# EAGLE design esmsx (EAGLE 9.0.1)
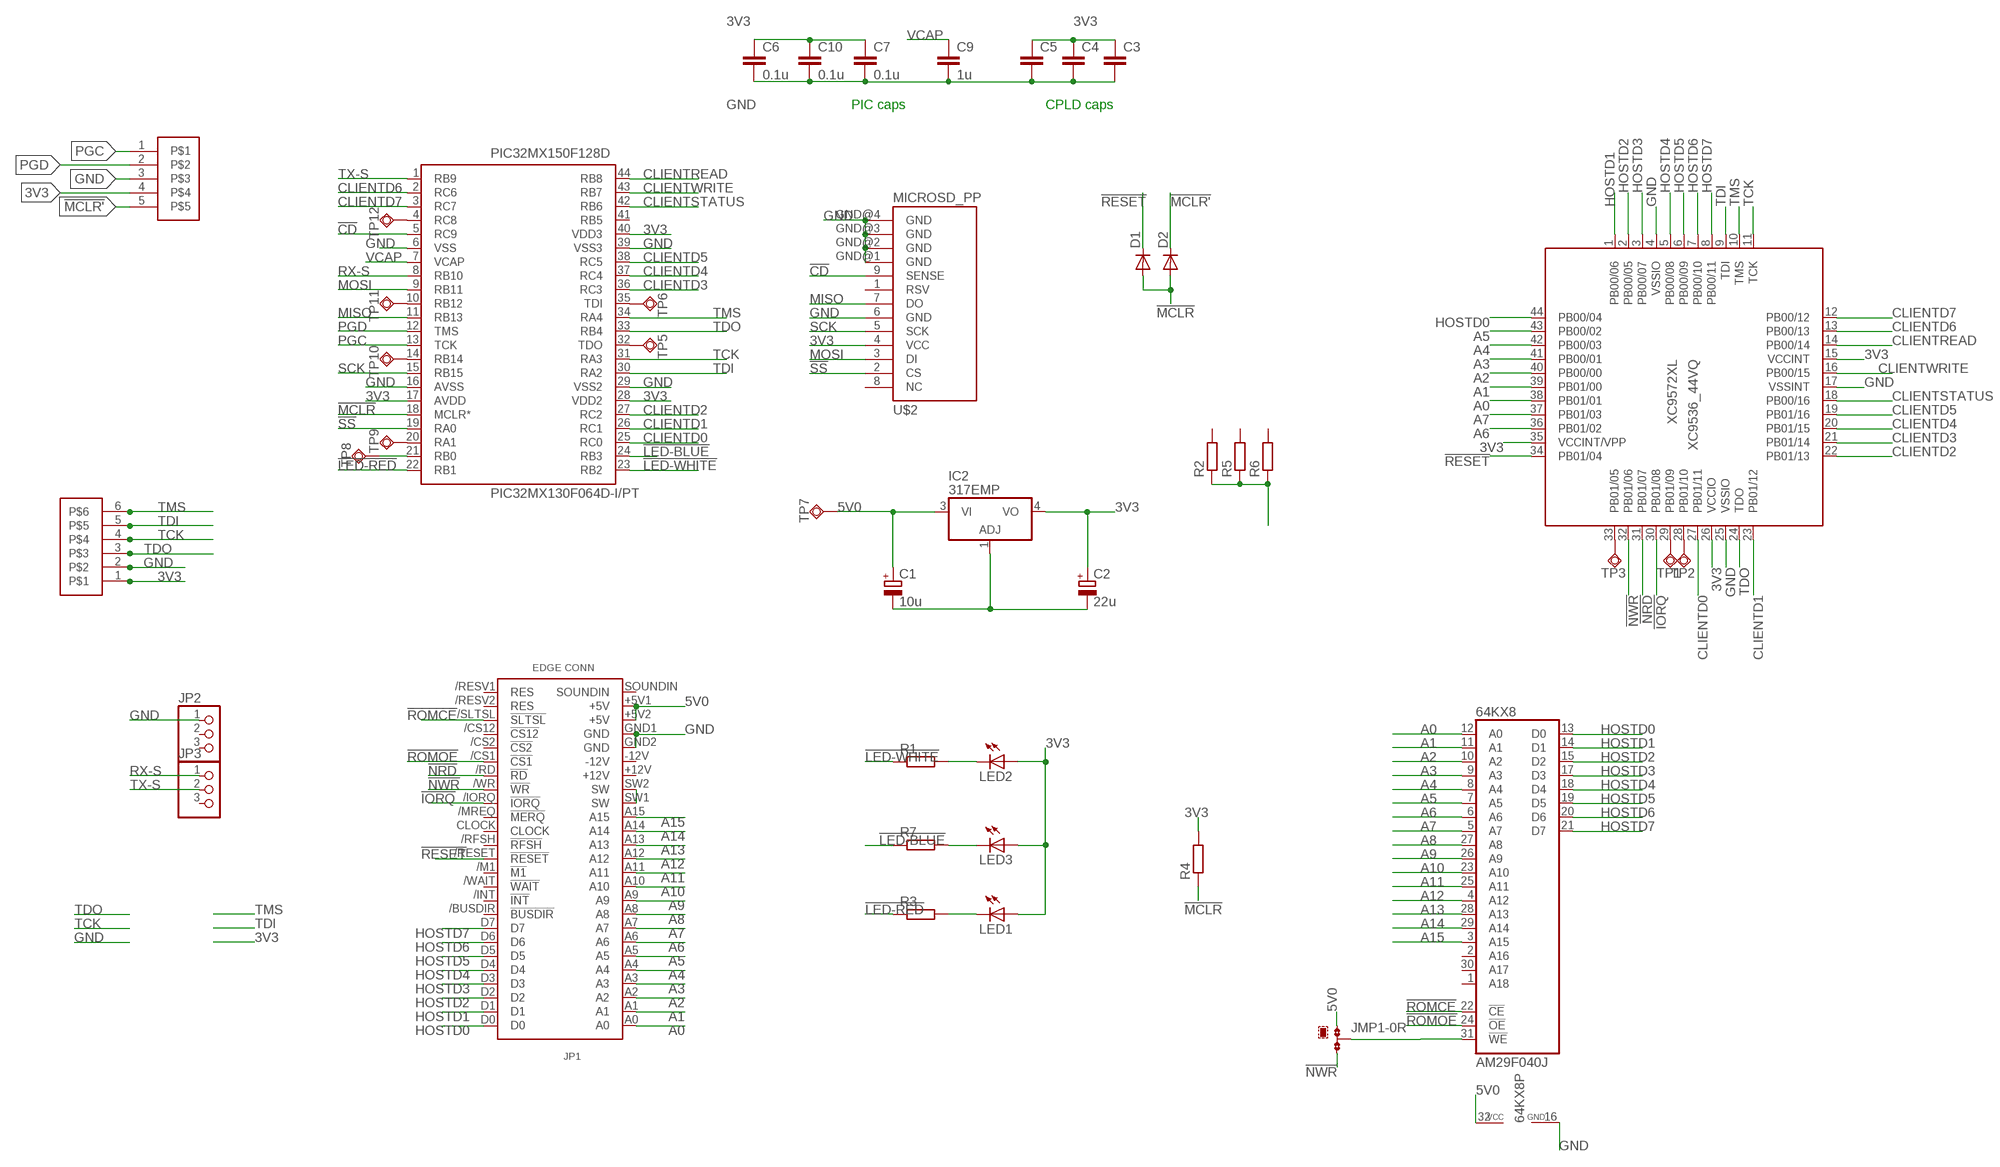
[diagram p0: schematic, sheet 1]

## Parts
64KX8  AM29F040J  [PLCC32R]
C1  10u  CPOL-EUSMCB  [SMC_B]
C2  22u  CPOL-EUSMCB  [SMC_B]
C3  C-EUC0805  [C0805]
C4  C-EUC0805  [C0805]
C5  C-EUC0805  [C0805]
C6  0.1u  C-EUC0805  [C0805]
C7  0.1u  C-EUC0805  [C0805]
C9  1u  C-EUC0805  [C0805]
C10  0.1u  C-EUC0805  [C0805]
D1  DIODE-SOD123  [SOD123]
D2  DIODE-SOD123  [SOD123]
IC2  317EMP  [SOT223]
JMP1  0R-JUMPA  [A0R-JMP]
JP1  MSXCART  [MSXCART]
JP2  PINHD-1X3  [1X03]
JP3  PINHD-1X3  [1X03]
LED1  LEDCHIPLED_1206  [CHIPLED_1206]
LED2  LEDCHIPLED_1206  [CHIPLED_1206]
LED3  LEDCHIPLED_1206  [CHIPLED_1206]
PIC32MX150F128D  PIC32MX130F064D-I/PT  [QFP80P1200X1200X120-44N]
R1  R-EU_R0805W  [R0805W]
R2  R-EU_R0805W  [R0805W]
R3  R-EU_R0805W  [R0805W]
R4  R-EU_R0805W  [R0805W]
R5  R-EU_R0805W  [R0805W]
R6  R-EU_R0805W  [R0805W]
R7  R-EU_R0805W  [R0805W]
TP1  TPSQTP20SQ  [TP20SQ]
TP2  TPSQTP20SQ  [TP20SQ]
TP3  TPSQTP20SQ  [TP20SQ]
TP5  TPSQTP20SQ  [TP20SQ]
TP6  TPSQTP20SQ  [TP20SQ]
TP7  TPSQTP20SQ  [TP20SQ]
TP8  TPSQTP20SQ  [TP20SQ]
TP9  TPSQTP20SQ  [TP20SQ]
TP10  TPSQTP20SQ  [TP20SQ]
TP11  TPSQTP20SQ  [TP20SQ]
TP12  TPSQTP20SQ  [TP20SQ]
U$2  MICROSD_PP  [MICROSD_PP]
U$3  6PIN  [1X04-1.27MM]
U$4  5PIN  [1X05-1.27MM]
XC9572XL  XC9536_44VQ  [SQFP-S-10X10-44]

## Nets
3V3: C2.+ C3.1 C4.1 C5.1 C6.1 C7.1 C10.1 IC2.4(VO) LED1.A LED2.A LED3.A PIC32MX150F128D.17(AVDD) PIC32MX150F128D.28(VDD2) PIC32MX150F128D.40(VDD3) R4.2 U$2.4(VCC) U$3.1 U$4.4 XC9572XL.15(VCCINT) XC9572XL.26(VCCIO) XC9572XL.35(VCCINT/VPP)
5V0: 64KX8.31(!WE) 64KX8.32(VCC) C1.+ IC2.3(VI) JMP1.1 JMP1.2 JP1.+5V1(+5V) JP1.+5V2(+5V) R2.1 R5.1 R6.1 TP7.TP
!CD: PIC32MX150F128D.5(RC9) U$2.9(SENSE)
!ERR': LED2.C R1.2
!IORQ: JP1./IORQ(!IORQ) XC9572XL.30(PB01/08)
!LED-BLUE: PIC32MX150F128D.24(RB3) R7.1
!LED-RED: PIC32MX150F128D.22(RB1) R3.1
!LED-WHITE: PIC32MX150F128D.23(RB2) R1.1
!MCLR: D1.A D2.A PIC32MX150F128D.18(MCLR*) R4.1
!MCLR': D2.C U$4.5
!NRD: JP1./RD(!RD) XC9572XL.31(PB01/07)
!NWR: JMP1.3 JP1./WR(!WR) XC9572XL.32(PB01/06)
!RESET: D1.C JP1./RESET(!RESET) XC9572XL.34(PB01/04)
!ROMCE: 64KX8.22(!CE) JP1./SLTSL(!SLTSL)
!ROMOE: 64KX8.24(!OE) JP1./CS1(!CS1)
!SS: PIC32MX150F128D.19(RA0) U$2.2(CS)
A0: 64KX8.12(A0) JP1.A0 XC9572XL.38(PB01/01)
A1: 64KX8.11(A1) JP1.A1 XC9572XL.39(PB01/00)
A2: 64KX8.10(A2) JP1.A2 XC9572XL.40(PB00/00)
A3: 64KX8.9(A3) JP1.A3 XC9572XL.41(PB00/01)
A4: 64KX8.8(A4) JP1.A4 XC9572XL.42(PB00/03)
A5: 64KX8.7(A5) JP1.A5 XC9572XL.43(PB00/02)
A6: 64KX8.6(A6) JP1.A6 XC9572XL.36(PB01/02)
A7: 64KX8.5(A7) JP1.A7 XC9572XL.37(PB01/03)
A8: 64KX8.27(A8) JP1.A8
A9: 64KX8.26(A9) JP1.A9
A10: 64KX8.23(A10) JP1.A10
A11: 64KX8.25(A11) JP1.A11
A12: 64KX8.4(A12) JP1.A12
A13: 64KX8.28(A13) JP1.A13
A14: 64KX8.29(A14) JP1.A14
A15: 64KX8.3(A15) JP1.A15
CLIENTD0: PIC32MX150F128D.25(RC0) XC9572XL.27(PB01/11)
CLIENTD1: PIC32MX150F128D.26(RC1) XC9572XL.23(PB01/12)
CLIENTD2: PIC32MX150F128D.27(RC2) XC9572XL.22(PB01/13)
CLIENTD3: PIC32MX150F128D.36(RC3) XC9572XL.21(PB01/14)
CLIENTD4: PIC32MX150F128D.37(RC4) XC9572XL.20(PB01/15)
CLIENTD5: PIC32MX150F128D.38(RC5) XC9572XL.19(PB01/16)
CLIENTD6: PIC32MX150F128D.2(RC6) XC9572XL.13(PB00/13)
CLIENTD7: PIC32MX150F128D.3(RC7) XC9572XL.12(PB00/12)
CLIENTREAD: PIC32MX150F128D.44(RB8) XC9572XL.14(PB00/14)
CLIENTSTATUS: PIC32MX150F128D.42(RB6) XC9572XL.18(PB00/16)
CLIENTWRITE: PIC32MX150F128D.43(RB7) XC9572XL.16(PB00/15)
GND: 64KX8.16(GND) C1.- C2.- C3.2 C4.2 C5.2 C6.2 C7.2 C9.2 C10.2 IC2.1(ADJ) JP1.GND1(GND) JP1.GND2(GND) JP2.1 PIC32MX150F128D.6(VSS) PIC32MX150F128D.16(AVSS) PIC32MX150F128D.29(VSS2) PIC32MX150F128D.39(VSS3) U$2.6(GND) U$2.GND@1(GND) U$2.GND@2(GND) U$2.GND@3(GND) U$2.GND@4(GND) U$3.2 U$4.3 XC9572XL.4(VSSIO) XC9572XL.17(VSSINT) XC9572XL.25(VSSIO)
HOSTD0: 64KX8.13(D0) JP1.D0 XC9572XL.44(PB00/04)
HOSTD1: 64KX8.14(D1) JP1.D1 XC9572XL.1(PB00/06)
HOSTD2: 64KX8.15(D2) JP1.D2 XC9572XL.2(PB00/05)
HOSTD3: 64KX8.17(D3) JP1.D3 XC9572XL.3(PB00/07)
HOSTD4: 64KX8.18(D4) JP1.D4 XC9572XL.5(PB00/08)
HOSTD5: 64KX8.19(D5) JP1.D5 XC9572XL.6(PB00/09)
HOSTD6: 64KX8.20(D6) JP1.D6 XC9572XL.7(PB00/10)
HOSTD7: 64KX8.21(D7) JP1.D7 XC9572XL.8(PB00/11)
MISO: PIC32MX150F128D.11(RB13) U$2.7(DO)
MOSI: PIC32MX150F128D.9(RB11) U$2.3(DI)
N$1: LED1.C R3.2
N$2: JP1.SW1(SW) JP1.SW2(SW)
N$4: PIC32MX150F128D.21(RB0) TP8.TP
N$6: TP1.TP XC9572XL.29(PB01/09)
N$7: TP2.TP XC9572XL.28(PB01/10)
N$8: TP3.TP XC9572XL.33(PB01/05)
N$9: PIC32MX150F128D.32(TDO) TP5.TP
N$10: PIC32MX150F128D.35(TDI) TP6.TP
N$11: LED3.C R7.2
N$12: PIC32MX150F128D.20(RA1) TP9.TP
N$13: PIC32MX150F128D.14(RB14) TP10.TP
N$14: PIC32MX150F128D.10(RB12) TP11.TP
N$15: PIC32MX150F128D.4(RC8) TP12.TP
PGC: PIC32MX150F128D.13(TCK) U$4.1
PGD: PIC32MX150F128D.12(TMS) U$4.2
RX-S: JP3.1 PIC32MX150F128D.8(RB10)
SCK: PIC32MX150F128D.15(RB15) U$2.5(SCK)
TCK: PIC32MX150F128D.31(RA3) U$3.4 XC9572XL.11(TCK)
TDI: PIC32MX150F128D.30(RA2) U$3.5 XC9572XL.9(TDI)
TDO: PIC32MX150F128D.33(RB4) U$3.3 XC9572XL.24(TDO)
TMS: PIC32MX150F128D.34(RA4) U$3.6 XC9572XL.10(TMS)
TX-S: JP3.2 PIC32MX150F128D.1(RB9)
VCAP: C9.1 PIC32MX150F128D.7(VCAP)
Unconnected: 64KX8.1(A18) 64KX8.2(A16) 64KX8.30(A17) JP1.+12V JP1.-12V JP1./BUSDIR(!BUSDIR) JP1./CS2(!CS2) JP1./CS12(!CS12) JP1./INT(!INT) JP1./M1(!M1) JP1./MREQ(!MERQ) JP1./RESV1(RES) JP1./RESV2(RES) JP1./RFSH(!RFSH) JP1./WAIT(!WAIT) JP1.CLOCK JP1.SOUNDIN JP2.2 JP2.3 JP3.3 PIC32MX150F128D.41(RB5) R2.2 R5.2 R6.2 U$2.1(RSV) U$2.8(NC)

## Notes on the sheet
- PIC caps | CPLD caps

## Library data of the parts
64KX8 = am29-memory:AM29F040J: 4-Megabit FLASH MEMORY (512 K x 8 bit) 5 V-only
C1 C2 = rcl:CPOL-EU: POLARIZED CAPACITOR, European symbol
C3-C5 C7 C9 C10 = rcl:C-EU: CAPACITOR, European symbol
C6 = rcl:C-EU: CAPACITOR, European symbol; SPICEPREFIX: C
D1 D2 = diode:DIODE-: DIODE
IC2 = linear:*317: Positive VOLTAGE REGULATOR
JMP1 = jump-0r-smd:0R-JUMP: SMD 0R 0805 Jumper
JP1 = msx-con:MSXCART
JP2 JP3 = pinhead-round:PINHD-1X3: PIN HEADER
LED1-LED3 = led:LED: LED OSRAM: - CHIPLED LG R971, LG N971, LY N971, LG Q971, LY Q971, LO R971, LY R971 LH N974, LH R974 LS Q976, LO Q976, LY Q976 LO Q996 - Hyper CHIPLED LW Q18S LB Q993, LB Q99A, LB R99A - SideLED LS A670, LO A670, LY A670, LG A670, LP A670 LB A673, LV A673, LT A673, LW A673 LH A674 LY A675 LS A676, LA A676, LO A676, LY A676, LW A676 LS A679, LY A679, LG A679 - Hyper Micro SIDELED® LS Y876, LA Y876, LO Y876, LY Y876 LT Y87S - SmartLED LW L88C, LW L88S LB L89C, LB L89S, LG L890 LS L89K, LO L89K, LY L89K LS L896, LA L896, LO L896, LY L896 - TOPLED LS T670, LO T670, LY T670, LG T670, LP T670 LSG T670, LSP T670, LSY T670, LOP T670, LYG T670 LG T671, LOG T671, LSG T671 LB T673, LV T673, LT T673, LW T673 LH T674 LS T676, LA T676, LO T676, LY T676, LB T676, LH T676, LSB T676, LW T676 LB T67C, LV T67C, LT T67C, LS T67K, LO T67K, LY T67K, LW E67C LS E67B, LA E67B, LO E67B, LY E67B, LB E67C, LV E67C, LT E67C LW T67C LS T679, LY T679, LG T679 LS T770, LO T770, LY T770, LG T770, LP T770 LB T773, LV T773, LT T773, LW T773 LH T774 LS E675, LA E675, LY E675, LS T675 LS T776, LA T776, LO T776, LY T776, LB T776 LHGB T686 LT T68C, LB T68C - Hyper Mini TOPLED® LB M676 - Mini TOPLED Santana® LG M470 LS M47K, LO M47K, LY M47K Source: http://www.osram.convergy.de LUXEON: - LUMILED® LXK2-PW12-R00, LXK2-PW12-S00, LXK2-PW14-U00, LXK2-PW14-V00 LXK2-PM12-R00, LXK2-PM12-S00, LXK2-PM14-U00 LXK2-PE12-Q00, LXK2-PE12-R00, LXK2-PE12-S00, LXK2-PE14-T00, LXK2-PE14-U00 LXK2-PB12-K00, LXK2-PB12-L00, LXK2-PB12-M00, LXK2-PB14-N00, LXK2-PB14-P00, LXK2-PB14-Q00 LXK2-PR12-L00, LXK2-PR12-M00, LXK2-PR14-Q00, LXK2-PR14-R00 LXK2-PD12-Q00, LXK2-PD12-R00, LXK2-PD12-S00 LXK2-PH12-R00, LXK2-PH12-S00 LXK2-PL12-P00, LXK2-PL12-Q00, LXK2-PL12-R00 Source: www.luxeon.com KINGBRIGHT: KA-3528ASYC Source: www.kingbright.com
PIC32MX150F128D = Microchip-PIC32MX1-2-3-4-5-6-7:PIC32MX1: IC,32-bit Microcontrollers (up to 128 KB Flash and 32 KB SRAM) with Audio and Graphics Interfaces, USB, and Advanced Analog; MPN: PIC32MX130F064D-I/PT; OC_FARNELL: 2097777; OC_NEWARK: 73T1366; PACKAGE: 44-Lead TQFP; SUPPLIER: Microchip
R1-R3 R5-R7 = resistor:R-EU_: RESISTOR, European symbol
R4 = rcl:R-EU_: RESISTOR, European symbol; SPICEPREFIX: R
TP1-TP3 TP5-TP12 = testpad:TPSQ: Test pad
U$2 = DE1594-v2:MICROSD_PP
U$3 = SparkFun:6PIN
U$4 = smb-microheaders:5PIN
XC9572XL = xilinx-xc9:XC9536_44VQ: xc9536_pc44 XC9500 In-System Programmable CPLD Family Auto generated by make-symbol-device-package-bsdl.ulp Rev. 34 Source: xc9536_vq44.bsd; MPN: XC9536-15VQG44C; OC_FARNELL: 1193227; OC_NEWARK: 98K3377

## Board
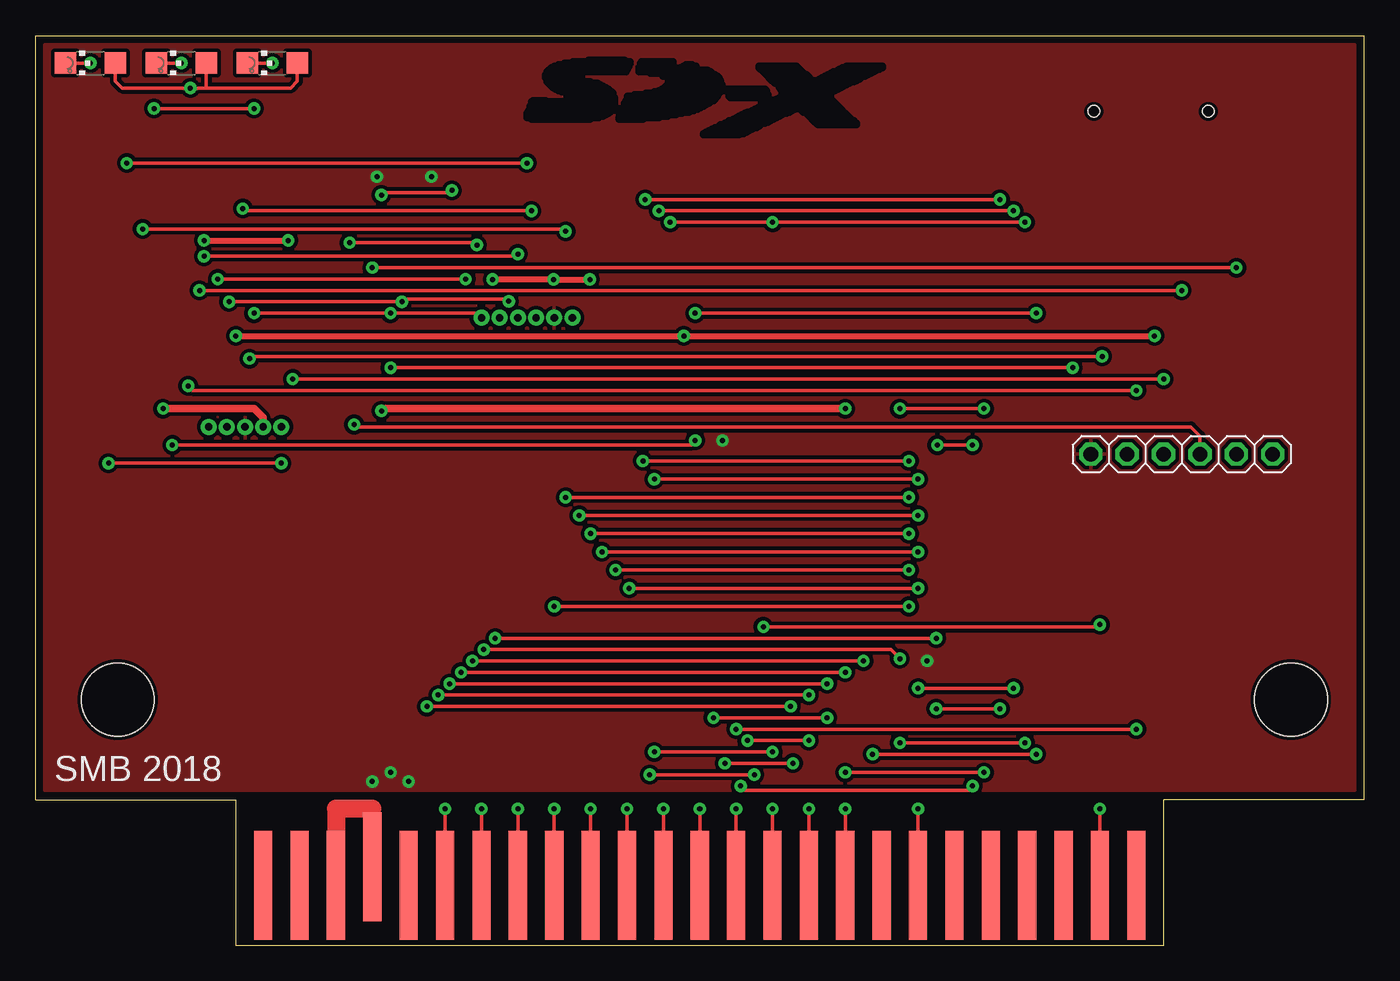
[diagram p1: board, top side]
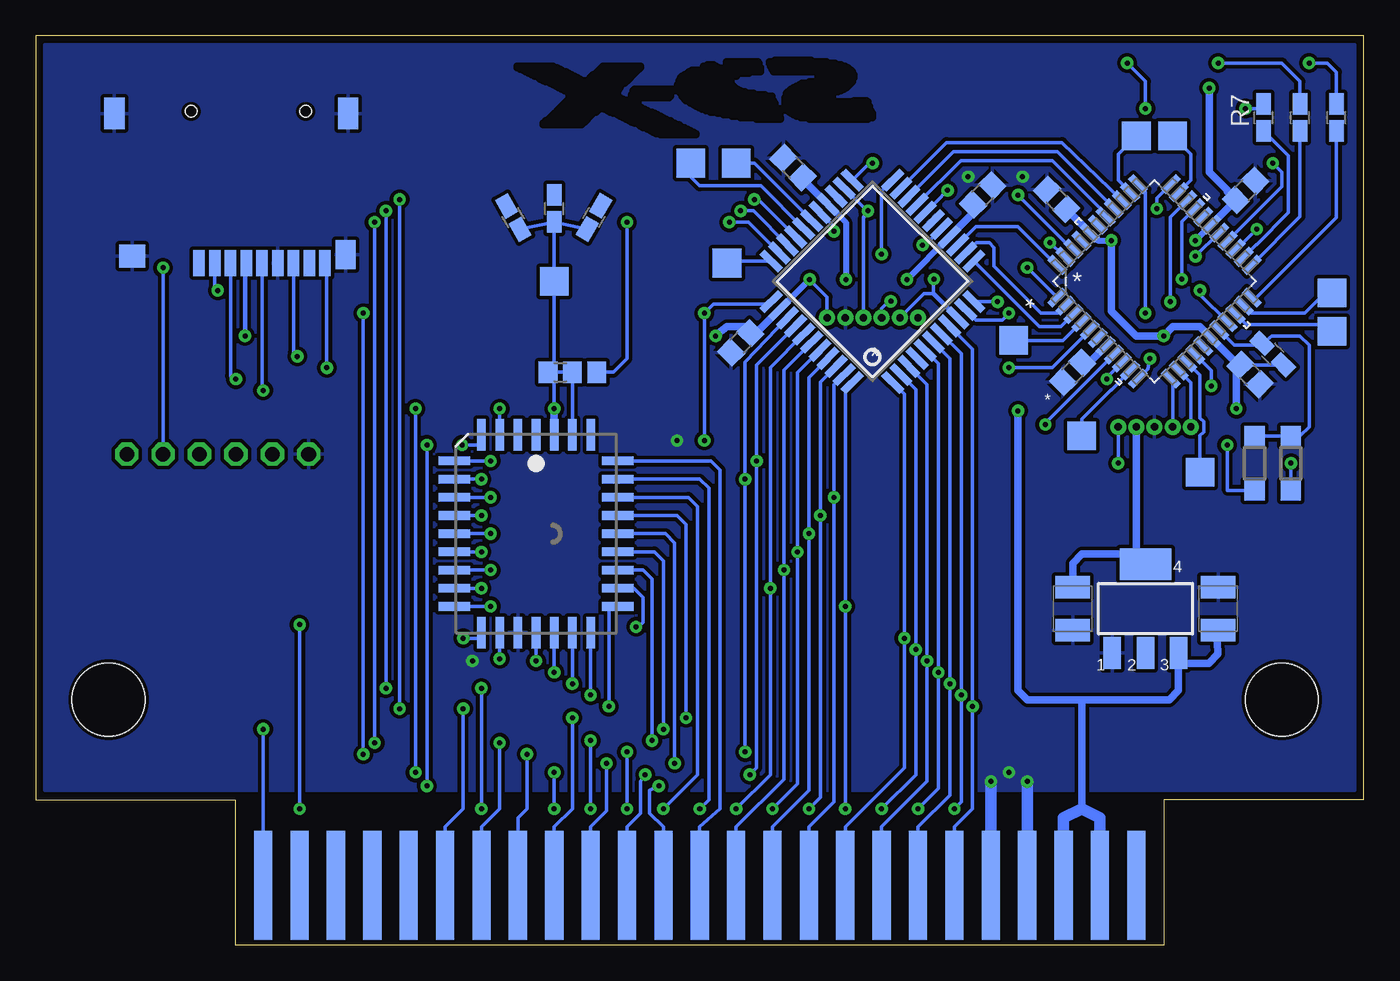
[diagram p2: board, bottom side, seen from below]

Size 92.71 x 63.5 mm. Coordinates in mm from the lower left corner, seen from the top.
Copper layers (1*16): Top 0.035mm / dielectric 1.5mm / Bottom 0.035mm
Design rules "SparkFun": minimum track width 8mil, minimum drill 20mil, track to track 8mil, track to pad 8mil, pad to pad 8mil, via to via 8mil, smd to smd 8mil, copper to edge 10mil, drill to drill 8mil, minimum pad ring 12mil, minimum via ring 10mil, stop-mask expansion 4mil, vias tented up to drill 25mil, thermal gap 10mil
tRestrict: area 46.6,56.6 to 49.1,56.7; area 46.8,56.7 to 49.4,56.8; area 47,56.8 to 49.6,56.9; area 47.2,56.9 to 49.8,57; area 47.4,57 to 50,57.1; area 47.7,57.1 to 50.3,57.2; area 47.8,57.2 to 50.5,57.3; area 48.1,57.3 to 50.6,57.4; area 54.6,57.3 to 57.3,57.4; area 48.3,57.4 to 50.9,57.5; area 54.5,57.4 to 57.2,57.5; area 48.4,57.5 to 51.1,57.6; area 54.4,57.5 to 57.1,57.6; area 48.7,57.6 to 51.3,57.7; area 54.3,57.6 to 56.9,57.7; area 34.6,57.7 to 38.7,57.8; area 40.7,57.7 to 42.4,57.8; area 48.9,57.7 to 51.5,57.8; area 54.2,57.7 to 56.8,57.8; area 34.3,57.8 to 39.3,57.9; area 40.8,57.8 to 43.5,57.9; area 49.1,57.8 to 51.7,57.9; area 54.1,57.8 to 56.7,57.9; area 34.3,57.9 to 39.6,58; area 40.8,57.9 to 44.1,58; area 49.3,57.9 to 51.9,58; area 54,57.9 to 56.6,58; area 34.3,58 to 39.8,58.1; area 40.8,58 to 44.7,58.1; area 49.5,58 to 52.1,58.1; area 53.9,58 to 56.5,58.1; area 34.4,58.1 to 40,58.2; area 40.9,58.1 to 45.1,58.2; area 49.7,58.1 to 52.4,58.2; area 53.8,58.1 to 56.4,58.2; area 34.4,58.2 to 40.1,58.3; area 40.9,58.2 to 45.6,58.3; area 50,58.2 to 52.6,58.3; area 53.6,58.2 to 56.3,58.3; area 34.5,58.3 to 40.2,58.4; area 41,58.3 to 45.9,58.4; area 50.2,58.3 to 52.8,58.4; area 53.5,58.3 to 56.2,58.4; area 34.5,58.4 to 40.3,58.5; area 41,58.4 to 46.2,58.5; area 50.4,58.4 to 53,58.5; area 53.4,58.4 to 56.1,58.5; area 34.5,58.5 to 40.3,58.6; area 41.1,58.5 to 46.4,58.6; area 50.6,58.5 to 53.2,58.6; area 53.3,58.5 to 56,58.6; area 34.6,58.6 to 40.4,58.7; area 41.1,58.6 to 46.6,58.7; area 50.8,58.6 to 55.9,58.7; area 34.6,58.7 to 40.4,58.8; area 41.1,58.7 to 46.8,58.8; area 51,58.7 to 55.8,58.8; area 34.6,58.8 to 40.4,58.9; area 41.2,58.8 to 47,58.9; area 51.2,58.8 to 55.7,58.9; area 34.7,58.9 to 35.6,59; area 38,58.9 to 40.4,59; area 41.2,58.9 to 47.1,59; area 51.5,58.9 to 55.6,59; area 38.1,59 to 40.4,59.1; area 41.3,59 to 47.3,59.1; area 51.7,59 to 55.5,59.1; area 38.1,59.1 to 40.4,59.2; area 41.3,59.1 to 47.4,59.2; area 51.9,59.1 to 55.4,59.2; area 38,59.2 to 40.3,59.3; area 41.3,59.2 to 47.5,59.3; area 48.5,59.2 to 51.1,59.3; area 52.1,59.2 to 55.3,59.3; area 37.7,59.3 to 40.3,59.4; area 41.8,59.3 to 47.6,59.4; area 48.4,59.3 to 51.1,59.4; area 52.3,59.3 to 55.2,59.4; area 37.4,59.4 to 40.3,59.5; area 42.6,59.4 to 47.6,59.5; area 48.4,59.4 to 51,59.5; area 52.5,59.4 to 55.1,59.5; area 37,59.5 to 40.2,59.6; area 43.2,59.5 to 47.7,59.6; area 48.4,59.5 to 51,59.6; area 52.3,59.5 to 55.4,59.6; area 36.7,59.6 to 40.1,59.7; area 43.5,59.6 to 47.8,59.7; area 48.3,59.6 to 51,59.7; area 52.2,59.6 to 55.6,59.7; area 36.5,59.7 to 40,59.8; area 43.7,59.7 to 47.8,59.8; area 48.4,59.7 to 50.9,59.8; area 52.1,59.7 to 55.8,59.8; area 36.3,59.8 to 39.8,59.9; area 43.9,59.8 to 47.8,59.9; area 52,59.8 to 56,59.9; area 36.1,59.9 to 39.6,60; area 44,59.9 to 47.9,60; area 51.9,59.9 to 56.2,60; area 36,60 to 39.4,60.1; area 44.1,60 to 47.9,60.1; area 51.9,60 to 56.4,60.1; area 35.9,60.1 to 39.2,60.2; area 44.2,60.1 to 47.8,60.2; area 51.8,60.1 to 56.6,60.2; area 35.8,60.2 to 38.7,60.3; area 44.2,60.2 to 47.8,60.3; area 51.6,60.2 to 56.8,60.3; area 35.7,60.3 to 38.2,60.4; area 44.2,60.3 to 47.8,60.4; area 51.5,60.3 to 54.1,60.4; area 54.5,60.3 to 57.1,60.4; area 35.7,60.4 to 37.8,60.5; area 44.2,60.4 to 47.7,60.5; area 51.4,60.4 to 54,60.5; area 54.7,60.4 to 57.3,60.5; area 35.7,60.5 to 37.5,60.6; area 44.4,60.5 to 47.7,60.6; area 51.3,60.5 to 54,60.6; area 54.9,60.5 to 57.5,60.6; area 35.6,60.6 to 37.3,60.7; area 44.8,60.6 to 47.6,60.7; area 51.2,60.6 to 53.9,60.7; area 55.1,60.6 to 57.6,60.7; area 35.6,60.7 to 37.3,60.8; area 43.8,60.7 to 44.3,60.8; area 45.2,60.7 to 47.4,60.8; area 51.1,60.7 to 53.8,60.8; area 55.3,60.7 to 57.9,60.8; area 35.7,60.8 to 37.3,60.9; area 44,60.8 to 44.7,60.9; area 45.7,60.8 to 47.2,60.9; area 51,60.8 to 53.6,60.9; area 55.5,60.8 to 58.1,60.9; area 35.7,60.9 to 37.7,61; area 42.9,60.9 to 43.4,61; area 44.3,60.9 to 45,61; area 46.2,60.9 to 47.1,61; area 50.9,60.9 to 53.5,61; area 55.7,60.9 to 58.3,61; area 35.8,61 to 41.2,61.1; area 42.1,61 to 43.6,61.1; area 44.5,61 to 45.3,61.1; area 46.5,61 to 46.9,61.1; area 50.8,61 to 53.4,61.1; area 56,61 to 58.5,61.1; area 35.9,61.1 to 41.2,61.2; area 42.1,61.1 to 43.7,61.2; area 44.7,61.1 to 45.6,61.2; area 50.7,61.1 to 53.3,61.2; area 56.1,61.1 to 58.7,61.2; area 36,61.2 to 41.3,61.3; area 42.1,61.2 to 43.8,61.3; area 45,61.2 to 45.9,61.3; area 50.6,61.2 to 53.2,61.3; area 56.3,61.2 to 58.9,61.3; area 36.2,61.3 to 41.3,61.4; area 42.2,61.3 to 44,61.4; area 45.2,61.3 to 46.1,61.4; area 50.5,61.3 to 53.1,61.4; area 56.6,61.3 to 59.1,61.4; area 36.5,61.4 to 41.4,61.5; area 42.2,61.4 to 44.2,61.5; area 45.4,61.4 to 45.8,61.5; area 36.9,61.5 to 41.4,61.6; area 42.2,61.5 to 44.4,61.6; area 37.5,61.6 to 41.5,61.7; area 42.3,61.6 to 44.5,61.7; area 38.6,61.7 to 41.1,61.8
bRestrict: area 46.6,56.6 to 49.1,56.7; area 46.8,56.7 to 49.4,56.8; area 47,56.8 to 49.6,56.9; area 47.2,56.9 to 49.8,57; area 47.4,57 to 50,57.1; area 47.7,57.1 to 50.3,57.2; area 47.8,57.2 to 50.5,57.3; area 48.1,57.3 to 50.6,57.4; area 54.6,57.3 to 57.3,57.4; area 48.3,57.4 to 50.9,57.5; area 54.5,57.4 to 57.2,57.5; area 48.4,57.5 to 51.1,57.6; area 54.4,57.5 to 57.1,57.6; area 48.7,57.6 to 51.3,57.7; area 54.3,57.6 to 56.9,57.7; area 34.6,57.7 to 38.7,57.8; area 40.7,57.7 to 42.4,57.8; area 48.9,57.7 to 51.5,57.8; area 54.2,57.7 to 56.8,57.8; area 34.3,57.8 to 39.3,57.9; area 40.8,57.8 to 43.5,57.9; area 49.1,57.8 to 51.7,57.9; area 54.1,57.8 to 56.7,57.9; area 34.3,57.9 to 39.6,58; area 40.8,57.9 to 44.1,58; area 49.3,57.9 to 51.9,58; area 54,57.9 to 56.6,58; area 34.3,58 to 39.8,58.1; area 40.8,58 to 44.7,58.1; area 49.5,58 to 52.1,58.1; area 53.9,58 to 56.5,58.1; area 34.4,58.1 to 40,58.2; area 40.9,58.1 to 45.1,58.2; area 49.7,58.1 to 52.4,58.2; area 53.8,58.1 to 56.4,58.2; area 34.4,58.2 to 40.1,58.3; area 40.9,58.2 to 45.6,58.3; area 50,58.2 to 52.6,58.3; area 53.6,58.2 to 56.3,58.3; area 34.5,58.3 to 40.2,58.4; area 41,58.3 to 45.9,58.4; area 50.2,58.3 to 52.8,58.4; area 53.5,58.3 to 56.2,58.4; area 34.5,58.4 to 40.3,58.5; area 41,58.4 to 46.2,58.5; area 50.4,58.4 to 53,58.5; area 53.4,58.4 to 56.1,58.5; area 34.5,58.5 to 40.3,58.6; area 41.1,58.5 to 46.4,58.6; area 50.6,58.5 to 53.2,58.6; area 53.3,58.5 to 56,58.6; area 34.6,58.6 to 40.4,58.7; area 41.1,58.6 to 46.6,58.7; area 50.8,58.6 to 55.9,58.7; area 34.6,58.7 to 40.4,58.8; area 41.1,58.7 to 46.8,58.8; area 51,58.7 to 55.8,58.8; area 34.6,58.8 to 40.4,58.9; area 41.2,58.8 to 47,58.9; area 51.2,58.8 to 55.7,58.9; area 34.7,58.9 to 35.6,59; area 38,58.9 to 40.4,59; area 41.2,58.9 to 47.1,59; area 51.5,58.9 to 55.6,59; area 38.1,59 to 40.4,59.1; area 41.3,59 to 47.3,59.1; area 51.7,59 to 55.5,59.1; area 38.1,59.1 to 40.4,59.2; area 41.3,59.1 to 47.4,59.2; area 51.9,59.1 to 55.4,59.2; area 38,59.2 to 40.3,59.3; area 41.3,59.2 to 47.5,59.3; area 48.5,59.2 to 51.1,59.3; area 52.1,59.2 to 55.3,59.3; area 37.7,59.3 to 40.3,59.4; area 41.8,59.3 to 47.6,59.4; area 48.4,59.3 to 51.1,59.4; area 52.3,59.3 to 55.2,59.4; area 37.4,59.4 to 40.3,59.5; area 42.6,59.4 to 47.6,59.5; area 48.4,59.4 to 51,59.5; area 52.5,59.4 to 55.1,59.5; area 37,59.5 to 40.2,59.6; area 43.2,59.5 to 47.7,59.6; area 48.4,59.5 to 51,59.6; area 52.3,59.5 to 55.4,59.6; area 36.7,59.6 to 40.1,59.7; area 43.5,59.6 to 47.8,59.7; area 48.3,59.6 to 51,59.7; area 52.2,59.6 to 55.6,59.7; area 36.5,59.7 to 40,59.8; area 43.7,59.7 to 47.8,59.8; area 48.4,59.7 to 50.9,59.8; area 52.1,59.7 to 55.8,59.8; area 36.3,59.8 to 39.8,59.9; area 43.9,59.8 to 47.8,59.9; area 52,59.8 to 56,59.9; area 36.1,59.9 to 39.6,60; area 44,59.9 to 47.9,60; area 51.9,59.9 to 56.2,60; area 36,60 to 39.4,60.1; area 44.1,60 to 47.9,60.1; area 51.9,60 to 56.4,60.1; area 35.9,60.1 to 39.2,60.2; area 44.2,60.1 to 47.8,60.2; area 51.8,60.1 to 56.6,60.2; area 35.8,60.2 to 38.7,60.3; area 44.2,60.2 to 47.8,60.3; area 51.6,60.2 to 56.8,60.3; area 35.7,60.3 to 38.2,60.4; area 44.2,60.3 to 47.8,60.4; area 51.5,60.3 to 54.1,60.4; area 54.5,60.3 to 57.1,60.4; area 35.7,60.4 to 37.8,60.5; area 44.2,60.4 to 47.7,60.5; area 51.4,60.4 to 54,60.5; area 54.7,60.4 to 57.3,60.5; area 35.7,60.5 to 37.5,60.6; area 44.4,60.5 to 47.7,60.6; area 51.3,60.5 to 54,60.6; area 54.9,60.5 to 57.5,60.6; area 35.6,60.6 to 37.3,60.7; area 44.8,60.6 to 47.6,60.7; area 51.2,60.6 to 53.9,60.7; area 55.1,60.6 to 57.6,60.7; area 35.6,60.7 to 37.3,60.8; area 43.8,60.7 to 44.3,60.8; area 45.2,60.7 to 47.4,60.8; area 51.1,60.7 to 53.8,60.8; area 55.3,60.7 to 57.9,60.8; area 35.7,60.8 to 37.3,60.9; area 44,60.8 to 44.7,60.9; area 45.7,60.8 to 47.2,60.9; area 51,60.8 to 53.6,60.9; area 55.5,60.8 to 58.1,60.9; area 35.7,60.9 to 37.7,61; area 42.9,60.9 to 43.4,61; area 44.3,60.9 to 45,61; area 46.2,60.9 to 47.1,61; area 50.9,60.9 to 53.5,61; area 55.7,60.9 to 58.3,61; area 35.8,61 to 41.2,61.1; area 42.1,61 to 43.6,61.1; area 44.5,61 to 45.3,61.1; area 46.5,61 to 46.9,61.1; area 50.8,61 to 53.4,61.1; area 56,61 to 58.5,61.1; area 35.9,61.1 to 41.2,61.2; area 42.1,61.1 to 43.7,61.2; area 44.7,61.1 to 45.6,61.2; area 50.7,61.1 to 53.3,61.2; area 56.1,61.1 to 58.7,61.2; area 36,61.2 to 41.3,61.3; area 42.1,61.2 to 43.8,61.3; area 45,61.2 to 45.9,61.3; area 50.6,61.2 to 53.2,61.3; area 56.3,61.2 to 58.9,61.3; area 36.2,61.3 to 41.3,61.4; area 42.2,61.3 to 44,61.4; area 45.2,61.3 to 46.1,61.4; area 50.5,61.3 to 53.1,61.4; area 56.6,61.3 to 59.1,61.4; area 36.5,61.4 to 41.4,61.5; area 42.2,61.4 to 44.2,61.5; area 45.4,61.4 to 45.8,61.5; area 36.9,61.5 to 41.4,61.6; area 42.2,61.5 to 44.4,61.6; area 37.5,61.6 to 41.5,61.7; area 42.3,61.6 to 44.5,61.7; area 38.6,61.7 to 41.1,61.8

### Footprints (pad centres in the part's own frame; a part is rotated, then mirrored left to right if it is on the bottom)
PLCC32R = smd 0.6 x 2.2: 1 0,6.9; 2 -1.27,6.9; 3 -2.54,6.9; 4 -3.81,6.9; 14 -3.81,-6.9; 15 -2.54,-6.9; 16 -1.27,-6.9; 17 0,-6.9; 18 1.27,-6.9; 19 2.54,-6.9; 20 3.81,-6.9; 30 3.81,6.9; 31 2.54,6.9; 32 1.27,6.9 | smd 2.2 x 0.6: 5 -5.7,5.08; 6 -5.7,3.81; 7 -5.7,2.54; 8 -5.7,1.27; 9 -5.7,0; 10 -5.7,-1.27; 11 -5.7,-2.54; 12 -5.7,-3.81; 13 -5.7,-5.08; 21 5.7,-5.08; 22 5.7,-3.81; 23 5.7,-2.54; 24 5.7,-1.27; 25 5.7,0; 26 5.7,1.27; 27 5.7,2.54; 28 5.7,3.81; 29 5.7,5.08
SMC_B = smd 1.6 x 2.4: + -1.5,0; - 1.5,0
C0805 = smd 1.3 x 1.5: 1 -0.95,0; 2 0.95,0
SOD123 = smd 1.4 x 1.4: A 1.9,0; C -1.9,0
SOT223 = smd 1.219 x 2.235: 1 -2.311,-3.099; 2 0,-3.099; 3 2.311,-3.099 | smd 3.6 x 2.2: 4 0,3.099
A0R-JMP = smd 1.5 x 1.3: 1 0,1.7; 2 0,0; 3 0,-1.7
MSXCART = smd 1.27 x 7.62 bottom: +5V1 4.445,4.191; +5V2 6.985,4.191; /CS1 62.865,4.191; /CS12 60.325,4.191; /IORQ 50.165,4.191; /M1 52.705,4.191; /RESET 45.085,4.191; /RESV2 57.785,4.191; /WAIT 55.245,4.191; /WR 47.625,4.191; A1 29.845,4.191; A3 27.305,4.191; A5 24.765,4.191; A7 37.465,4.191; A9 42.545,4.191; A11 40.005,4.191; A12 34.925,4.191; A14 32.385,4.191; D1 22.225,4.191; D3 19.685,4.191; D5 17.145,4.191; D7 14.605,4.191; GND1 9.525,4.191; GND2 12.065,4.191; SOUNDIN 1.905,4.191 | smd 1.27 x 7.62: +12V 4.445,4.191; -12V 1.905,4.191; /BUSDIR 52.705,4.191; /CS2 62.865,4.191; /INT 55.245,4.191; /MREQ 50.165,4.191; /RD 47.625,4.191; /RESV1 45.085,4.191; /RFSH 57.785,4.191; /SLTSL 60.325,4.191; A0 29.845,4.191; A2 27.305,4.191; A4 24.765,4.191; A6 37.465,4.191; A8 34.925,4.191; A10 40.005,4.191; A13 32.385,4.191; A15 42.545,4.191; CLOCK 12.065,4.191; D0 22.225,4.191; D2 19.685,4.191; D4 17.145,4.191; D6 14.605,4.191; SW1 9.525,5.461; SW2 6.985,4.191 | hole 5.08: -8.255,17.145; 73.66,17.145
1X03 = drill 1.016 octagon: 1 -2.54,0; 2 0,0; 3 2.54,0
CHIPLED_1206 = smd 1.5 x 1.5: A 0,-1.75; C 0,1.75
QFP80P1200X1200X120-44N = smd 1.473 x 0.508: 1 -5.613,3.988; 2 -5.613,3.2; 3 -5.613,2.388; 4 -5.613,1.6; 5 -5.613,0.787; 6 -5.613,0; 7 -5.613,-0.787; 8 -5.613,-1.6; 9 -5.613,-2.388; 10 -5.613,-3.2; 11 -5.613,-3.988; 23 5.613,-3.988; 24 5.613,-3.2; 25 5.613,-2.388; 26 5.613,-1.6; 27 5.613,-0.787; 28 5.613,0; 29 5.613,0.787; 30 5.613,1.6; 31 5.613,2.388; 32 5.613,3.2; 33 5.613,3.988 | smd 0.508 x 1.473: 12 -3.988,-5.613; 13 -3.2,-5.613; 14 -2.388,-5.613; 15 -1.6,-5.613; 16 -0.787,-5.613; 17 0,-5.613; 18 0.787,-5.613; 19 1.6,-5.613; 20 2.388,-5.613; 21 3.2,-5.613; 22 3.988,-5.613; 34 3.988,5.613; 35 3.2,5.613; 36 2.388,5.613; 37 1.6,5.613; 38 0.787,5.613; 39 0,5.613; 40 -0.787,5.613; 41 -1.6,5.613; 42 -2.388,5.613; 43 -3.2,5.613; 44 -3.988,5.613
R0805W = smd 1.5 x 1: 1 -0.94,0; 2 0.94,0
R0805W' = smd 1.5 x 1: 1 -1.052,0; 2 1.052,0
TP20SQ = smd 2 x 2: TP 0,0
MICROSD_PP = smd 1.8 x 0.8: 1 0,3.85; 2 0,2.75; 3 0,1.65; 4 0,0.55; 5 0,-0.55; 6 0,-1.65; 7 0,-2.75; 8 0,-3.85; 9 0,-4.95 | smd 1.6 x 1.8: GND@1 0.5,8.5 | smd 2.2 x 1.4: GND@2 10.45,9.75; GND@4 10.45,-6.55 | smd 2 x 1.4: GND@3 0.6,-6.4 | hole 0.8: 10.6,4.4; 10.6,-3.6
1X04-1.27MM = drill 0.508 pad 1: 1 0,0; 2 1.27,0; 3 2.54,0; 4 3.81,0; 5 5.08,0; 6 6.35,0
1X05-1.27MM = drill 0.508 pad 1: 1 -2.54,0; 2 -1.27,0; 3 0,0; 4 1.27,0; 5 2.54,0
SQFP-S-10X10-44 = smd 0.5 x 1.8: 1 -4,-6; 2 -3.2,-6; 3 -2.4,-6; 4 -1.6,-6; 5 -0.8,-6; 6 0,-6; 7 0.8,-6; 8 1.6,-6; 9 2.4,-6; 10 3.2,-6; 11 4,-6; 23 4,6; 24 3.2,6; 25 2.4,6; 26 1.6,6; 27 0.8,6; 28 0,6; 29 -0.8,6; 30 -1.6,6; 31 -2.4,6; 32 -3.2,6; 33 -4,6 | smd 1.8 x 0.5: 12 6,-4; 13 6,-3.2; 14 6,-2.4; 15 6,-1.6; 16 6,-0.8; 17 6,0; 18 6,0.8; 19 6,1.6; 20 6,2.4; 21 6,3.2; 22 6,4; 34 -6,4; 35 -6,3.2; 36 -6,2.4; 37 -6,1.6; 38 -6,0.8; 39 -6,0; 40 -6,-0.8; 41 -6,-1.6; 42 -6,-2.4; 43 -6,-3.2; 44 -6,-4

### Placement (x,y rotation side)
64KX8  57.78,28.73 0 bottom
C1  10.16,23.5 90 bottom
C2  20.32,23.5 270 bottom
C3  21.43,52.07 135 bottom
C4  39.85,54.29 135 bottom
C5  8.26,52.7 45 bottom
C6  7.94,39.85 315 bottom
C7  43.5,42.07 225 bottom
C9  20.32,40 225 bottom
C10  26.6,52.39 45 bottom
D1  7.62,33.65 90 bottom
D2  5.08,33.65 90 bottom
IC2  15.24,23.5 0 bottom
JMP1  55.25,40 90 bottom
JP1  13.97,0 0 top
JP2  76.2,34.29 0 top
JP3  83.82,34.29 0 top
LED1  3.81,61.59 90 top
LED2  10.16,61.59 90 top
LED3  16.51,61.59 90 top
PIC32MX150F128D  14.61,46.35 45 bottom
R1  4.45,57.78 90 bottom
R2  59.37,50.8 120 bottom
R3  1.91,57.78 90 bottom
R4  [R0805W']  6.35,41.27 315 bottom
R5  53.74,50.82 60 bottom
R6  56.52,51.43 90 bottom
R7  6.99,57.78 90 bottom
TP1  46.99,54.61 0 bottom
TP2  43.81,54.61 0 bottom
TP3  44.45,47.62 0 bottom
TP5  13.34,56.51 0 bottom
TP6  15.88,56.51 0 bottom
TP7  56.52,46.35 0 bottom
TP8  2.22,45.56 0 bottom
TP9  2.22,42.86 0 bottom
TP10  11.43,33.02 0 bottom
TP11  19.68,35.56 0 bottom
TP12  24.45,42.23 0 bottom
U$2  77.47,47.62 90 bottom
U$3  37.47,43.81 180 top
U$4  14.61,36.2 0 top
XC9572XL  34.29,46.35 45 bottom

### Tracks (layer width: path | path; a pad name or v marks a point on that pad's centre or on a via)
3V3  (via drill 0.35)
  Top 0.254: LED1.A 5.56,60.32 6.03,59.85 v10.79,59.85 11.91,59.85 | LED2.A 11.91,60.01 | 11.91,60.01 | LED3.A 18.26,60.33 17.78,59.85 11.91,59.85 | 11.91,59.85 11.91,60.01
  Top 0.406: v38.69,46.48 v36.15,46.48 v31.9,46.48 | v78.11,42.54 v45.24,42.54 v13.97,42.54 | v11.75,49.21 v17.62,49.21
  Top 0.508: U$4.4 15.88,36.83 15.24,37.46 v8.89,37.46
  Bottom 0.254: 42.34,42.83 C7.1 | 27.41,50.97 C10.1 | XC9572XL.26 37.6,51.93 | 39.17,53.5 C4.1 | 8.93,40.68 8.88,40.65 C6.1 6.25,40.52 R4.2 | 20.44,51.08 C3.1 | U$3.1 37.47,45.26 v38.69,46.48
  Bottom 0.305: v78.11,42.54 78.11,46.9 U$2.4
  Bottom 0.406: v36.15,46.48 36.15,50.48 37.6,51.93 | v38.69,46.48 XC9572XL.35 | v31.9,46.48 XC9572XL.15 | PIC32MX150F128D.40 18.58,49.21 v17.62,49.21 | v11.75,49.21 PIC32MX150F128D.28
  Bottom 0.508: XC9572XL.35 42.34,42.83 | XC9572XL.15 27.41,50.97 | 37.6,51.93 39.17,53.5 | 8.93,40.68 PIC32MX150F128D.17 11.43,43.18 13.34,43.18 v13.97,42.54 15.88,42.54 17.62,44.29 v17.62,49.21 | PIC32MX150F128D.40 20.44,51.08 | PIC32MX150F128D.28 C5.1 9.53,52.63 9.53,52.7 10.79,53.97 v10.79,59.85 | C2.+ 20.32,26.67 19.68,27.3 15.88,27.3 | 15.88,27.3 15.24,26.67 IC2.4 | 15.88,27.3 U$4.4 | v8.89,37.46 8.89,40.65 8.88,40.65 | C7.1 42.79,43.18 44.45,43.18 45.08,42.7 v45.24,42.54
5V0  (via drill 0.35)
  Top 0.508: v56.52,37.46 24.45,37.46 v24.13,37.31
  Bottom 0.254: 56.52,40 TP7.TP R6.1 | 56.52,40 v56.52,37.46 | R5.1 R6.1 | R6.1 R2.1 | 56.52,40 JMP1.1 JMP1.2 64KX8.31
  Bottom 0.508: v24.13,37.31 24.13,17.78 23.5,17.14 19.68,17.14 | 19.68,17.14 13.56,17.14 12.93,17.78 IC2.3 12.86,19.68 10.82,19.68 10.18,20.34 10.24,21.91 C1.+ | 19.68,9.53 19.68,17.14 | v56.52,37.46 64KX8.32
  Bottom 0.813: JP1.+5V2 20.96,8.89 19.68,9.53 18.41,8.89 JP1.+5V1
!CD  (via drill 0.35)
  Top 0.254: v24.77,40.32 v72.39,40.32
  Bottom 0.254: PIC32MX150F128D.5 21.75,40.32 v24.77,40.32 | U$2.9 72.39,47.49 v72.39,40.32
!ERR'  (via drill 0.35)
  Top 0.254: LED2.C v10.16,61.59
  Bottom 0.254: R1.2 4.45,60.32 5.72,61.59 v10.16,61.59
!IORQ  (via drill 0.35)
  Top 0.254: v62.87,16.51 v67.31,16.51 | v67.31,52.07 v42.55,52.07
  Bottom 0.254: XC9572XL.30 42.27,52.07 v42.55,52.07 | JP1./IORQ 64.14,8.26 62.87,9.53 v62.87,16.51 | v67.31,16.51 v67.31,52.07
!LED-BLUE
  Bottom 0.254: PIC32MX150F128D.24 7.5,48.93 7.46,48.93 5.26,51.14 5.26,55.12 R7.1
!LED-RED
  Bottom 0.254: R3.1 1.91,50.8 7.5,45.21 PIC32MX150F128D.22
!LED-WHITE
  Bottom 0.254: PIC32MX150F128D.23 4.45,50.88 R1.1
!MCLR
  Bottom 0.254: PIC32MX150F128D.18 9.05,41.91 7.2,41.91 R4.1 6.41,42.54 4.45,42.54 3.81,41.91 3.81,36.2 4.45,35.56 D2.A D1.A
!MCLR'  (via drill 0.35)
  Top 0.254: v17.14,33.65 v5.08,33.65
  Bottom 0.254: v5.08,33.65 D2.C | U$4.5 v17.14,33.65
!NRD  (via drill 0.35)
  Top 0.254: JP1./RD v61.59,9.53 | v61.59,17.94 v68.26,17.94 | v68.26,51.28 v43.5,51.28
  Bottom 0.254: XC9572XL.31 42.61,51.28 v43.5,51.28 | v61.59,9.53 v61.59,17.94 | v68.26,17.94 v68.26,51.28
!NWR  (via drill 0.35)
  Top 0.254: v60.33,14.13 v69.06,14.13 | v69.06,50.48 v51.44,50.48 v44.29,50.48
  Bottom 0.254: JP1./WR 61.59,8.26 60.33,9.53 v60.33,14.13 | v69.06,14.13 v69.06,50.48 | v44.29,50.48 42.94,50.48 XC9572XL.32 | JMP1.3 52.39,40 51.44,40.96 v51.44,50.48 51.44,50.64
!RESET  (via drill 0.35)
  Top 0.254: v58.42,13.34 v69.85,13.34 | v46.04,44.13 v69.85,44.13 | v46.04,35.24 46,35.21 45.81,34.92 v9.53,34.92
  Bottom 0.254: JP1./RESET 59.06,8.89 58.42,9.53 v58.42,13.34 | XC9572XL.34 41.59,44.77 45.4,44.77 v46.04,44.13 v46.04,35.24 | v69.85,44.13 v69.85,13.34 | D1.C 9.52,31.75 v9.53,34.92
!ROMCE  (via drill 0.35)
  Top 0.254: v50.8,22.23 74.14,22.23 v74.3,22.38 | v74.3,9.53 JP1./SLTSL
  Bottom 0.254: 64KX8.22 50.96,24.92 50.32,24.29 50.32,22.54 50.8,22.07 v50.8,22.23 | v74.3,22.38 v74.3,9.53
!ROMOE  (via drill 0.35)
  Top 0.254: v48.89,15.08 v76.84,15.08
  Bottom 0.254: 64KX8.24 49.53,27.46 48.89,26.83 v48.89,15.08 | v76.84,15.08 JP1./CS1
!SS  (via drill 0.35)
  Top 0.254: v11.43,45.72 v80.01,45.72
  Bottom 0.254: PIC32MX150F128D.19 11.43,45.44 v11.43,45.72 | v80.01,45.72 80.22,45.93 U$2.2
A0  (via drill 0.35)
  Top 0.254: JP1.A0 v43.81,9.53 | v61.59,24.92 v41.43,24.92
  Bottom 0.254: XC9572XL.38 41.43,40.34 v41.43,24.92 41.43,11.91 v43.81,9.53 | 64KX8.12 v61.59,24.92
A1  (via drill 0.35)
  Top 0.254: v60.96,26.19 v40.48,26.19
  Bottom 0.254: XC9572XL.39 40.48,40.16 v40.48,26.19 40.48,11.59 43.81,8.26 JP1.A1 43.81,3.81 | 64KX8.11 v60.96,26.19
A2  (via drill 0.35)
  Top 0.254: JP1.A2 v41.28,9.53 | v61.59,27.46 v39.53,27.46
  Bottom 0.254: XC9572XL.40 39.53,39.98 v39.53,27.46 39.53,11.27 v41.28,9.53 | 64KX8.10 v61.59,27.46
A3  (via drill 0.35)
  Top 0.254: v60.96,28.73 v38.73,28.73
  Bottom 0.254: XC9572XL.41 38.73,39.65 v38.73,28.73 38.73,10.79 41.28,8.26 JP1.A3 | 64KX8.9 v60.96,28.73
A4  (via drill 0.35)
  Top 0.254: JP1.A4 v38.73,9.53 | v61.59,30 v37.94,30
  Bottom 0.254: XC9572XL.42 37.94,39.31 v37.94,30 37.94,10.32 v38.73,9.53 | 64KX8.8 v61.59,30
A5  (via drill 0.35)
  Top 0.254: v60.96,31.27 v36.99,31.27
  Bottom 0.254: XC9572XL.43 36.99,39.13 v36.99,31.27 36.99,10 38.73,8.26 JP1.A5 | 64KX8.7 v60.96,31.27
A6  (via drill 0.35)
  Top 0.254: JP1.A6 v51.44,9.53 | v61.59,32.54 v43.18,32.54 | v51.44,13.49 v43.18,13.49
  Bottom 0.254: XC9572XL.36 43.18,40.7 v43.18,32.54 v43.18,13.49 | 64KX8.6 v61.59,32.54 | v51.44,9.53 v51.44,13.49
A7  (via drill 0.35)
  Top 0.254: v60.96,33.81 v42.39,33.81 | v50.17,11.91 v42.86,11.91
  Bottom 0.254: XC9572XL.37 42.39,40.52 v42.39,33.81 42.39,12.38 v42.86,11.91 | JP1.A7 51.44,8.26 50.48,9.21 50.48,11.43 v50.17,11.91 | 64KX8.5 v60.96,33.81
A8  (via drill 0.35)
  Top 0.254: JP1.A8 v48.89,9.53
  Bottom 0.254: 64KX8.27 47.15,31.27 46.51,30.64 46.51,11.91 v48.89,9.53
A9  (via drill 0.35)
  Top 0.254: v47.31,15.88 v55.25,15.88
  Bottom 0.254: 64KX8.26 47.94,30 47.31,29.37 v47.31,15.88 | v55.25,15.88 55.25,9.53 56.52,8.26 JP1.A9
A10  (via drill 0.35)
  Top 0.254: JP1.A10 v53.97,9.53 | v53.97,14.29 v49.69,14.29
  Bottom 0.254: v49.69,14.29 49.69,25.56 50.32,26.19 64KX8.23 | v53.97,9.53 v53.97,14.29
A11  (via drill 0.35)
  Top 0.254: v52.86,12.7 v48.1,12.7
  Bottom 0.254: JP1.A11 53.97,8.26 52.86,9.37 v52.86,12.7 | 64KX8.25 48.74,28.73 48.1,28.1 v48.1,12.7
A12  (via drill 0.35)
  Top 0.254: v62.95,34.92 v65.41,34.92 | v65.41,11.11 65.25,10.79 49.53,10.79 v49.21,11.11
  Bottom 0.254: JP1.A12 48.89,8.26 49.85,9.21 49.85,10.79 v49.21,11.11 | 64KX8.4 61.59,34.92 v62.95,34.92 | v65.41,34.92 v65.41,11.11
A13  (via drill 0.35)
  Top 0.254: JP1.A13 v46.36,9.53
  Bottom 0.254: 64KX8.28 46.36,32.54 45.72,31.91 45.72,10.16 v46.36,9.53
A14
  Bottom 0.254: 64KX8.29 45.56,33.81 44.93,33.18 44.93,9.53 46.36,8.26 JP1.A14
A15  (via drill 0.35)
  Top 0.254: v60.33,37.46 v66.2,37.46 | JP1.A15 v56.52,9.53 | v56.52,12.07 v66.2,12.07
  Bottom 0.254: 64KX8.3 v60.33,37.46 | v56.52,9.53 v56.52,12.07 | v66.2,12.07 v66.2,37.46
CLIENTD0  (via drill 0.35)
  Top 0.254: v36.99,49.85 36.83,50.01 v7.46,50.01
  Bottom 0.254: XC9572XL.27 36.97,50.16 v36.99,49.85 | v7.46,50.01 8.73,48.74 8.89,48.74 8.95,48.68 PIC32MX150F128D.25
CLIENTD1  (via drill 0.35)
  Top 0.254: v34.29,54.61 v6.35,54.61
  Bottom 0.254: XC9572XL.23 34.52,54.61 v34.29,54.61 | v6.35,54.61 5.72,53.97 5.72,52.98 PIC32MX150F128D.26
CLIENTD2  (via drill 0.35)
  Top 0.254: v33.66,48.26 33.5,48.1 v11.75,48.1
  Bottom 0.254: XC9572XL.22 33.66,52.65 v33.66,48.26 | PIC32MX150F128D.27 v11.75,48.1
CLIENTD3
  Bottom 0.254: XC9572XL.21 29.13,56.04 21.07,56.04 PIC32MX150F128D.36
CLIENTD4
  Bottom 0.254: XC9572XL.20 28.64,55.4 21.39,55.4 PIC32MX150F128D.37
CLIENTD5
  Bottom 0.254: XC9572XL.19 28.14,54.77 21.75,54.77 18.02,51.04 PIC32MX150F128D.38 17.93,50.93
CLIENTD6
  Bottom 0.254: XC9572XL.13 27.05,49.07 26.14,49.05 25.82,48.71 25.82,47.41 22.54,44.13 21.35,44.13 PIC32MX150F128D.2
CLIENTD7
  Bottom 0.254: XC9572XL.12 22.63,43.18 21.16,43.18 PIC32MX150F128D.3
CLIENTREAD
  Bottom 0.254: PIC32MX150F128D.44 21.47,47.5 24.13,50.16 27.09,50.16 XC9572XL.14
CLIENTSTATUS  (via drill 0.35)
  Top 0.254: v29.05,52.7 28.73,52.55 24.29,52.55 v24.13,52.39
  Bottom 0.254: XC9572XL.18 29.84,51.93 v29.05,52.7 | v24.13,52.39 20.54,48.79 PIC32MX150F128D.42
CLIENTWRITE  (via drill 0.35)
  Top 0.254: v21.91,49.05 30.64,49.05 v30.8,48.89
  Bottom 0.254: PIC32MX150F128D.43 21,48.21 21.03,48.21 v21.91,49.05 | XC9572XL.16 30.62,48.89 30.64,48.89 v30.8,48.89
GND  (via drill 0.35)
  Bottom 0.813: JP1.GND2 v26.04,11.43 | JP1.GND1 v23.5,11.43
  other vias: 47.94,35.24 62.23,19.84 27.62,53.66 23.81,53.66 24.77,12.07
  pour Bottom (isolate 0.254): 0.64,62.87 92.08,62.87 92.08,10.79 0.64,10.79
  pour Top (isolate 0.254): 0.64,62.87 92.08,62.87 92.08,10.79 0.64,10.79
HOSTD0  (via drill 0.35)
  Top 0.254: JP1.D0 v36.2,9.53 | v60.96,23.65 v36.2,23.65
  Bottom 0.254: XC9572XL.44 36.2,38.79 v36.2,23.65 v36.2,9.53 | 64KX8.13 v60.96,23.65
HOSTD1  (via drill 0.35)
  Top 0.254: v62.87,21.43 v32.07,21.43
  Bottom 0.254: XC9572XL.1 32.07,38.48 v32.07,21.43 32.07,12.38 36.2,8.26 JP1.D1 | 64KX8.14 61.59,21.43 v62.87,21.43
HOSTD2  (via drill 0.35)
  Top 0.254: JP1.D2 v33.66,9.53 | v60.33,20 59.69,20.64 v31.27,20.64
  Bottom 0.254: v33.66,9.53 31.27,11.91 v31.27,20.64 31.27,38.81 XC9572XL.2 | 64KX8.15 v60.33,20
HOSTD3  (via drill 0.35)
  Top 0.254: v57.78,19.84 v30.48,19.84
  Bottom 0.254: JP1.D3 33.66,8.26 30.48,11.43 v30.48,19.84 30.48,39.15 XC9572XL.3 | 64KX8.17 v57.78,19.84
HOSTD4  (via drill 0.35)
  Top 0.254: JP1.D4 v31.11,9.53 | v56.52,19.05 v29.69,19.05
  Bottom 0.254: XC9572XL.5 29.69,40.62 v29.69,19.05 29.69,10.95 v31.11,9.53 | 64KX8.18 v56.52,19.05
HOSTD5  (via drill 0.35)
  Top 0.254: v55.25,18.26 v28.89,18.26
  Bottom 0.254: JP1.D5 31.11,8.26 28.89,10.48 v28.89,18.26 28.89,40.96 XC9572XL.6 | 64KX8.19 v55.25,18.26
HOSTD6  (via drill 0.35)
  Top 0.254: JP1.D6 v28.57,9.53 | v53.97,17.46 v28.1,17.46
  Bottom 0.254: XC9572XL.7 28.1,41.29 v28.1,17.46 28.1,10 v28.57,9.53 | 64KX8.20 v53.97,17.46
HOSTD7  (via drill 0.35)
  Top 0.254: v52.7,16.67 v27.3,16.67
  Bottom 0.254: JP1.D7 28.57,8.26 27.3,9.53 v27.3,16.67 27.3,41.63 XC9572XL.8 | 64KX8.21 52.7,23.65 v52.7,16.67
MISO  (via drill 0.35)
  Top 0.254: v14.92,40.96 15.08,41.12 v74.45,41.12
  Bottom 0.254: PIC32MX150F128D.11 15.08,40.24 v14.92,40.96 | U$2.7 74.72,41.38 v74.45,41.12
MOSI  (via drill 0.35)
  Top 0.254: v17.94,39.53 v78.74,39.53
  Bottom 0.254: PIC32MX150F128D.9 17.94,39.64 v17.94,39.53 | U$2.3 79.12,39.75 78.74,39.37 v78.74,39.53
N$1  (via drill 0.35)
  Top 0.254: LED1.C v3.81,61.59
  Bottom 0.254: 3.75,61.53 v3.81,61.59 2.54,61.59 1.91,60.96 R3.2
N$2
  Top 1.27: JP1.SW1 23.5,9.53 20.96,9.53 JP1.SW2
N$4
  Bottom 0.254: PIC32MX150F128D.21 7.86,44.13 4.13,44.13 2.7,45.56 TP8.TP
N$6
  Bottom 0.254: XC9572XL.29 42.09,53.02 46.36,53.02 46.99,53.66 TP1.TP
N$7
  Bottom 0.254: XC9572XL.28 42.55,54.61 TP2.TP
N$8
  Bottom 0.254: XC9572XL.33 44.31,47.77 TP3.TP
N$9
  Bottom 0.254: PIC32MX150F128D.32 12.07,53.42 12.07,55.24 TP5.TP
N$10
  Bottom 0.254: PIC32MX150F128D.35 17.14,53.42 17.14,55.24 TP6.TP
N$11  (via drill 0.35)
  Top 0.254: v8.26,58.42 v15.24,58.42 | v16.51,61.59 LED3.C
  Bottom 0.254: R7.2 7.32,58.42 v8.26,58.42 | v15.24,58.42 15.24,60.32 v16.51,61.59
N$12
  Bottom 0.254: PIC32MX150F128D.20 8.21,43.34 2.38,43.34 2.22,43.18 TP9.TP
N$13
  Bottom 0.254: PIC32MX150F128D.14 11.43,39.8 11.43,36.82 11.18,36.56 11.18,35.83 11.43,35.57 TP10.TP
N$14
  Bottom 0.254: TP11.TP 19.68,36.75 17.66,38.77 17.62,38.77 17.18,39.21 17.18,39.25 PIC32MX150F128D.10
N$15
  Bottom 0.254: PIC32MX150F128D.4 21,42.23 TP12.TP
PGC
  Bottom 0.254: PIC32MX150F128D.13 12.07,39.29 U$4.1
PGD
  Bottom 0.254: PIC32MX150F128D.12 13.34,39.45 U$4.2
RX-S  (via drill 0.35)
  Top 0.254: v22.23,36.35 22.38,36.2 80.65,36.2 81.28,35.56 JP3.1
  Bottom 0.254: PIC32MX150F128D.8 22.23,36.47 v22.23,36.35
SCK  (via drill 0.35)
  Top 0.254: v10.64,39.05 10.95,38.73 v76.84,38.73
  Bottom 0.254: PIC32MX150F128D.15 10.64,40.12 v10.64,39.05 | U$2.5 76.92,38.82 v76.84,38.73
TCK  (via drill 0.35)
  Top 0.254: v13.49,44.93 v25.56,44.93 25.56,44.95 25.88,45.1 32.72,45.1 v33.02,44.96
  Bottom 0.254: XC9572XL.11 25.57,44.94 v25.56,44.93 | v13.49,44.93 13.49,50.84 PIC32MX150F128D.31 | U$3.4 33.66,44.45 33.02,45.08 v33.02,44.96
TDI  (via drill 0.35)
  Top 0.254: v30,46.51 v12.7,46.51
  Bottom 0.254: v12.7,46.51 12.7,50.52 PIC32MX150F128D.30 | v30,46.51 30.05,46.56 30.05,45.51 30.69,45.51 U$3.5
  Bottom 0.305: 30.05,45.51 XC9572XL.9
TDO  (via drill 0.35)
  Top 0.254: v14.45,51.43 14.76,51.28 v34.61,51.28
  Bottom 0.254: PIC32MX150F128D.33 14.45,52.15 v14.45,51.43 | U$3.3 34.92,50.8 v34.61,51.28 34.69,51.28 XC9572XL.24
TMS  (via drill 0.35)
  Top 0.254: v15.24,44.13 v24.77,44.13 30.8,44.13 U$3.6
  Bottom 0.254: XC9572XL.10 27.07,43.66 25.24,43.66 v24.77,44.13 | v15.24,44.13 15.24,52.55 15.32,52.7 PIC32MX150F128D.34
TX-S  (via drill 0.35)
  Top 0.254: v23.5,47.31 v83.82,47.31
  Bottom 0.254: v23.5,47.31 PIC32MX150F128D.1 | v83.82,47.31 JP3.2
VCAP
  Bottom 0.254: 19.29,40.56 C9.1
  Bottom 0.508: PIC32MX150F128D.7 19.29,40.56

### Text on the board
tNames: SMB 2018
tStop: Prototype
_bsilk: * | * | * | *